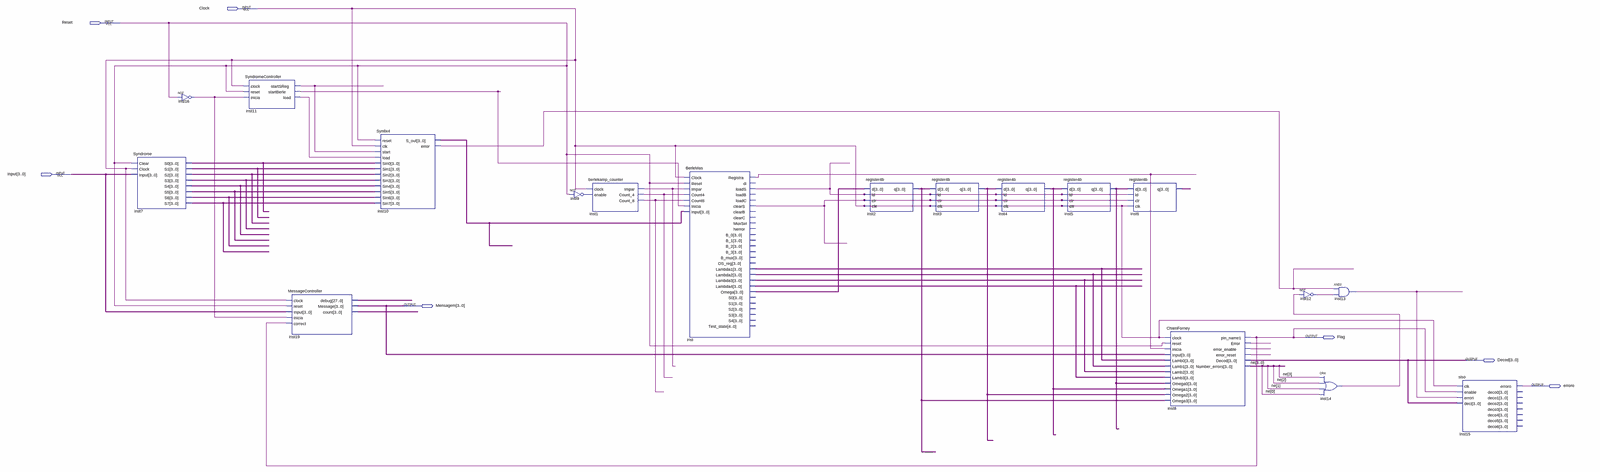
[diagram p0: schematic sheet, whole]
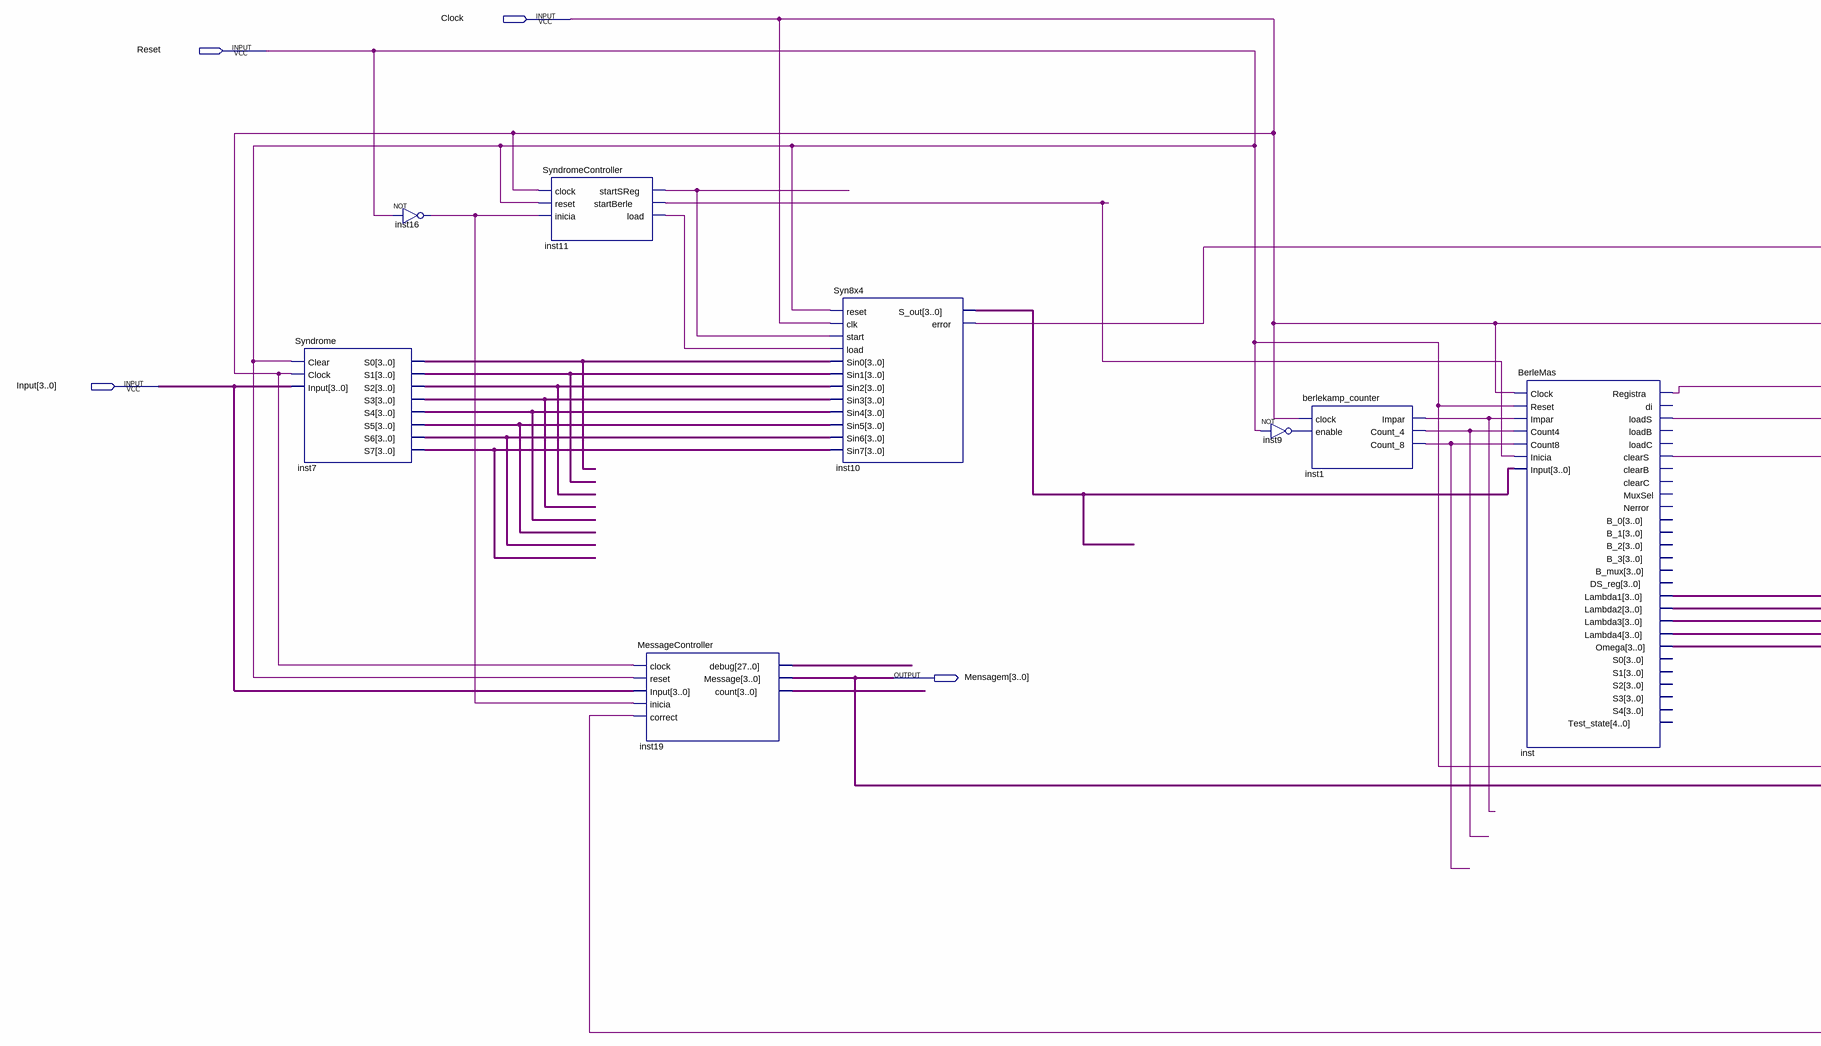
[diagram p1: schematic sheet, left part]
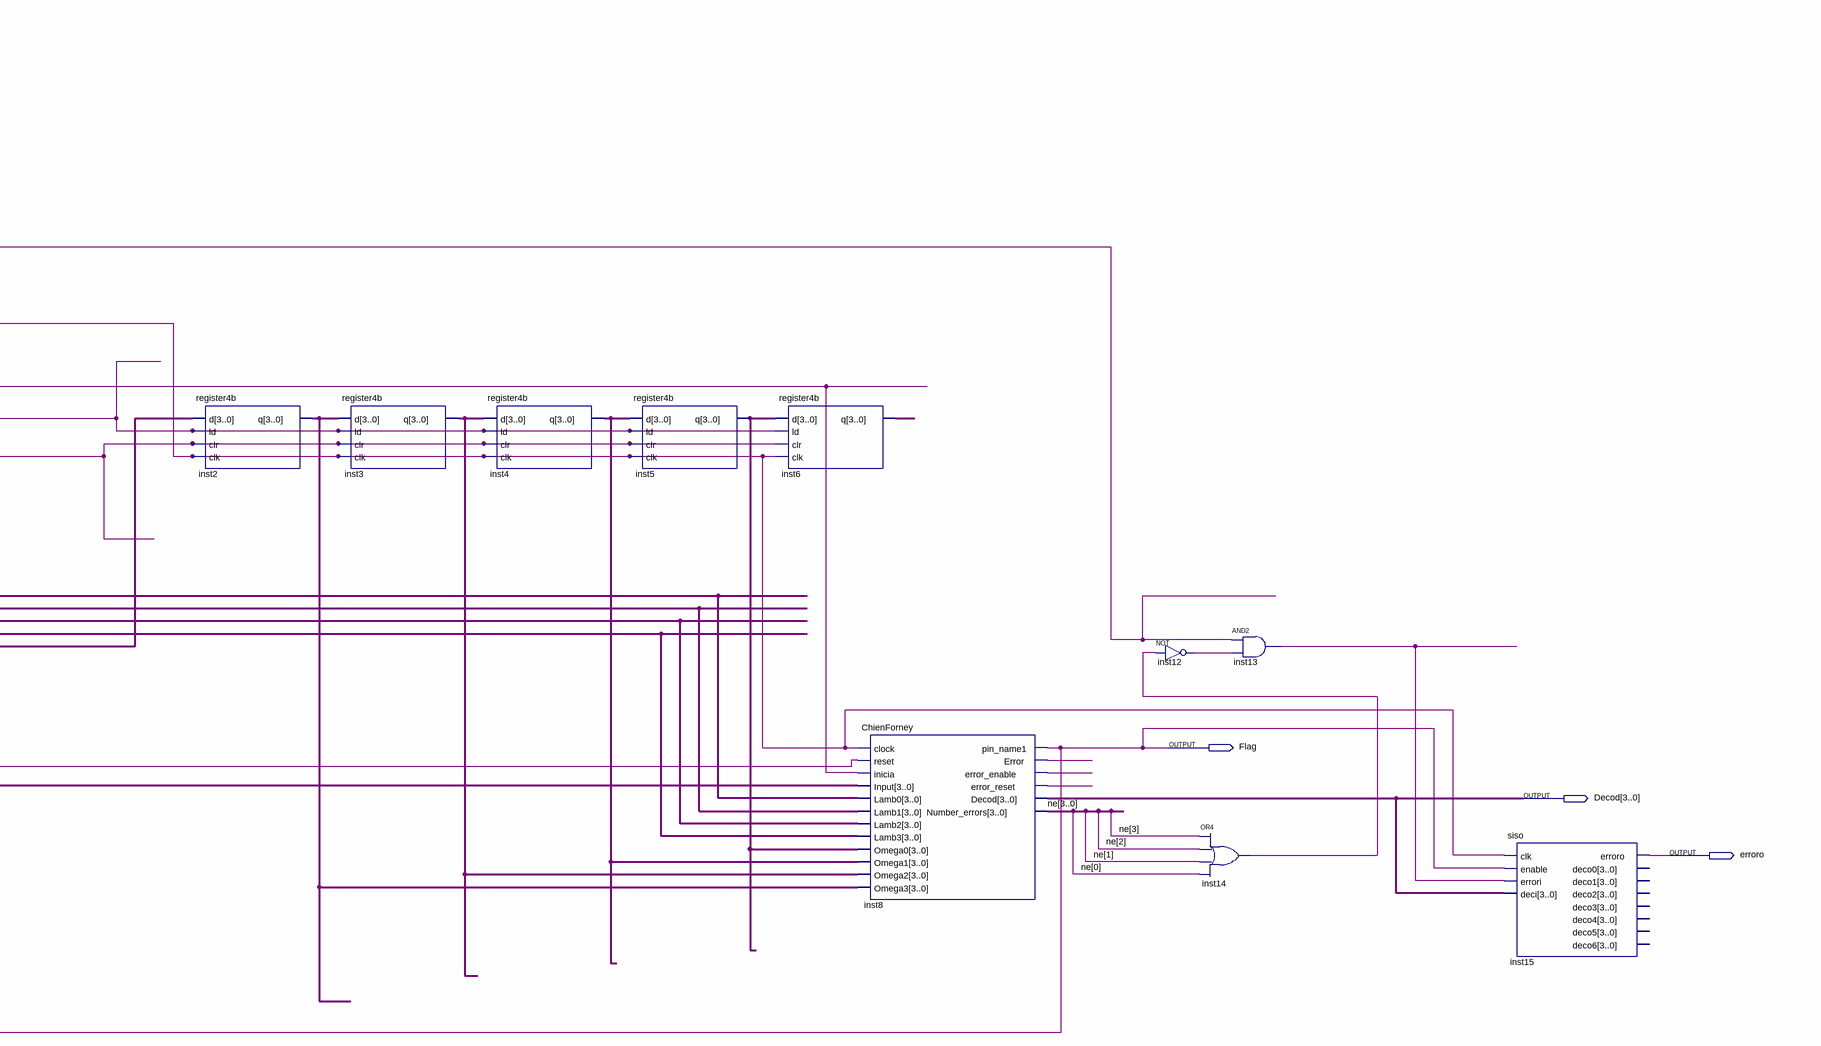
[diagram p2: schematic sheet, right part]
// Quartus schematic RSIntegration.bdf as structural Verilog: 18 symbols, 7 pins
module RSIntegration (
  input  Clock,
  input  Reset,
  input  [3:0] Input,
  output [3:0] Mensagem,
  output Flag,
  output [3:0] Decod,
  output erroro
);

  wire inst1_count_4, inst1_count_8, inst1_impar, inst8_error, inst8_error_enable, inst8_error_reset,
       inst9_out, inst10_error, inst11_load, inst11_startberle, inst11_startsreg, inst12_out, inst13_out,
       inst14_out, inst16_out, inst_clears, inst_loads, inst_registra;
  wire [3:0] inst2_q, inst3_q, inst4_q, inst5_q, inst6_q, inst7_s0, inst7_s1, inst7_s2, inst7_s3, inst7_s4,
       inst7_s5, inst7_s6, inst7_s7, inst10_s_out, inst19_count, inst_lambda1, inst_lambda2, inst_lambda3,
       inst_lambda4, inst_omega, ne;
  wire [27:0] inst19_debug;

  Syndrome inst7 (
    .Clear(Reset), .Clock(Clock), .Input(Input), .S0(inst7_s0), .S1(inst7_s1), .S2(inst7_s2), .S3(inst7_s3),
    .S4(inst7_s4), .S5(inst7_s5), .S6(inst7_s6), .S7(inst7_s7));
  not inst16 (inst16_out, Reset);
  SyndromeController inst11 (
    .clock(Clock), .reset(Reset), .inicia(inst16_out), .startSReg(inst11_startsreg),
    .startBerle(inst11_startberle), .load(inst11_load));
  MessageController inst19 (
    .clock(Clock), .reset(Reset), .Input(Input), .inicia(inst16_out), .correct(Flag), .debug(inst19_debug),
    .Message(Mensagem), .count(inst19_count));
  Syn8x4 inst10 (
    .reset(Reset), .clk(Clock), .start(inst11_startsreg), .load(inst11_load), .Sin0(inst7_s0),
    .Sin1(inst7_s1), .Sin2(inst7_s2), .Sin3(inst7_s3), .Sin4(inst7_s4), .Sin5(inst7_s5), .Sin6(inst7_s6),
    .Sin7(inst7_s7), .S_out(inst10_s_out), .error(inst10_error));
  berlekamp_counter inst1 (
    .clock(Clock), .enable(inst9_out), .Impar(inst1_impar), .Count_4(inst1_count_4), .Count_8(inst1_count_8));
  not inst9 (inst9_out, Reset);
  BerleMas inst (
    .Clock(Clock), .Reset(Reset), .Impar(inst1_impar), .Count4(inst1_count_4), .Count8(inst1_count_8),
    .Inicia(inst11_startberle), .Input(inst10_s_out), .Registra(inst_registra), .loadS(inst_loads),
    .clearS(inst_clears), .Lambda1(inst_lambda1), .Lambda2(inst_lambda2), .Lambda3(inst_lambda3),
    .Lambda4(inst_lambda4), .Omega(inst_omega));  // open: di, loadB, loadC, clearB, clearC, MuxSel, Nerror, B_0, B_1, B_2, B_3, B_mux, DS_reg, S0, S1, S2, S3, S4, Test_state
  register4b inst2 (.d(inst_omega), .ld(inst_loads), .clr(inst_clears), .clk(Clock), .q(inst2_q));
  register4b inst3 (.d(inst2_q), .ld(inst_loads), .clr(inst_clears), .clk(Clock), .q(inst3_q));
  register4b inst4 (.d(inst3_q), .ld(inst_loads), .clr(inst_clears), .clk(Clock), .q(inst4_q));
  register4b inst5 (.d(inst4_q), .ld(inst_loads), .clr(inst_clears), .clk(Clock), .q(inst5_q));
  register4b inst6 (.d(inst5_q), .ld(inst_loads), .clr(inst_clears), .clk(Clock), .q(inst6_q));
  ChienForney inst8 (
    .clock(Clock), .reset(Reset), .inicia(inst_registra), .Input(Mensagem), .Lamb0(inst_lambda1),
    .Lamb1(inst_lambda2), .Lamb2(inst_lambda3), .Lamb3(inst_lambda4), .Omega0(inst5_q), .Omega1(inst4_q),
    .Omega2(inst3_q), .Omega3(inst2_q), .pin_name1(Flag), .Error(inst8_error),
    .error_enable(inst8_error_enable), .error_reset(inst8_error_reset), .Decod(Decod), .Number_errors(ne));
  not inst12 (inst12_out, inst14_out);
  or inst14 (inst14_out, ne[3], ne[2], ne[1], ne[0]);
  and inst13 (inst13_out, inst10_error, inst12_out);
  siso inst15 (
    .clk(Clock), .enable(Flag), .errori(inst13_out), .deci(Decod), .erroro(erroro));  // open: deco0, deco1, deco2, deco3, deco4, deco5, deco6
endmodule
